# Altium schematic sheet AC-DC PS.SchDoc
size Letter; DocumentNumber: 7; SheetNumber: 7; SheetTotal: 11; Pagesize: Letter
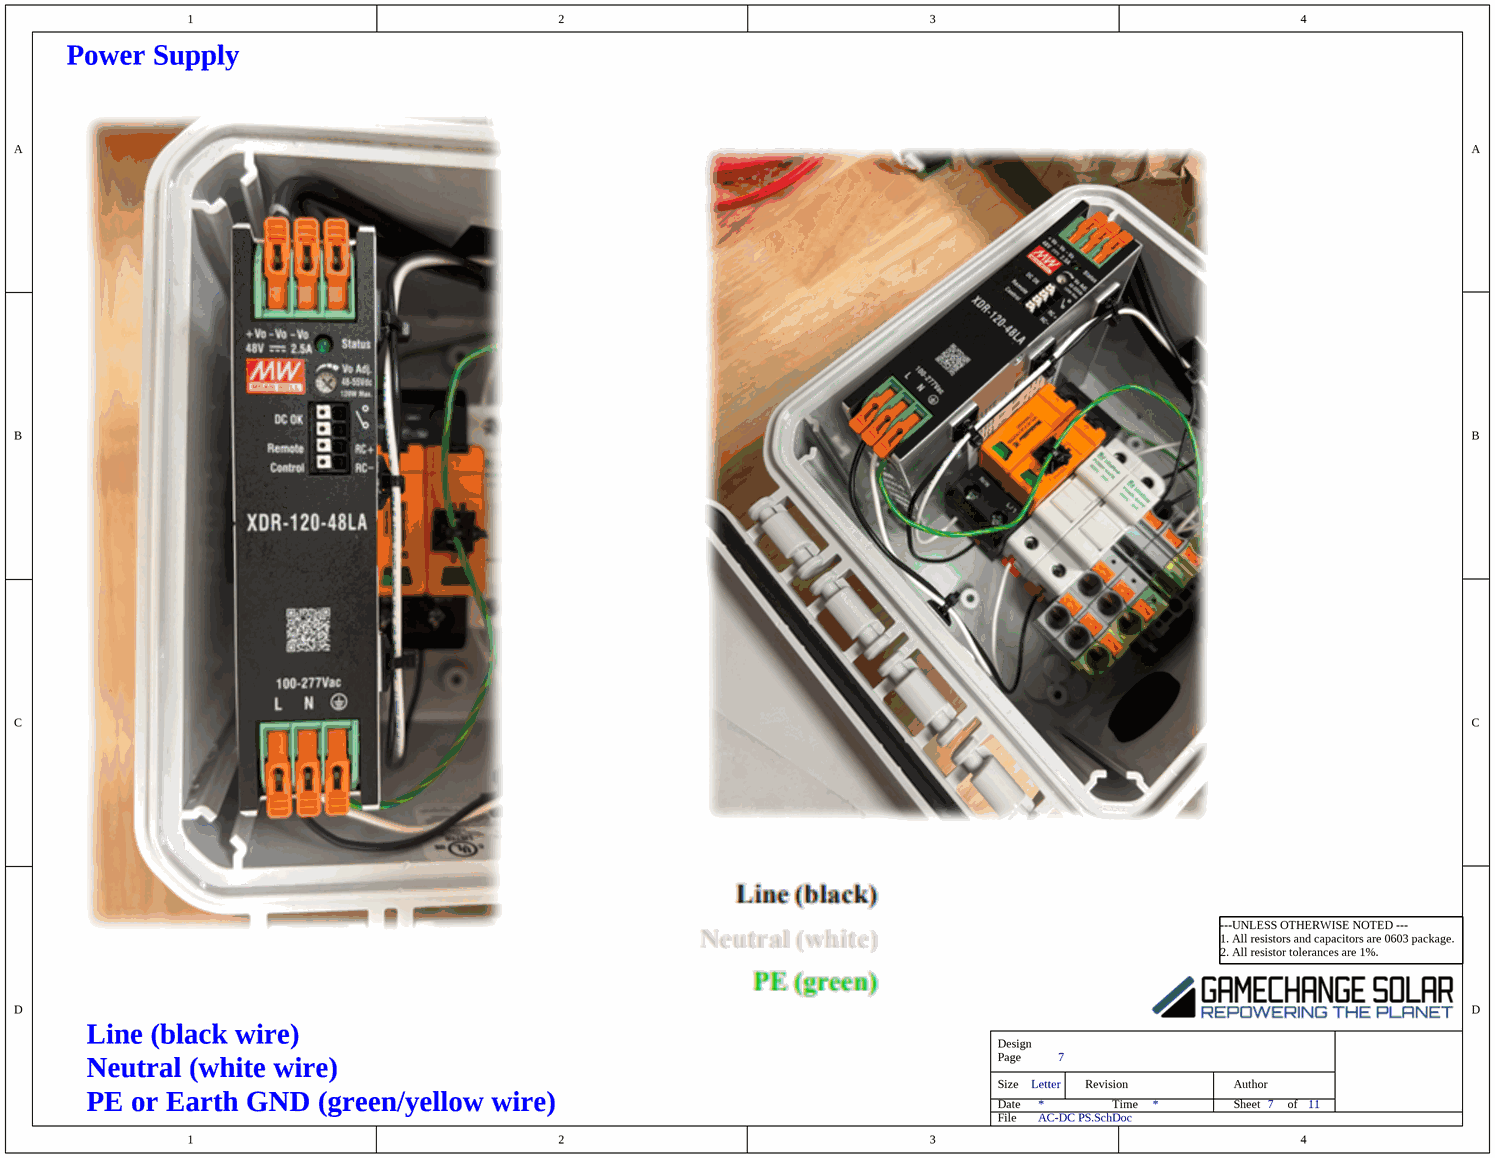
[diagram p0: AC-DC PS.SchDoc]

## Notes on the sheet
- Power Supply
- Line (black wire)
- Neutral (white wire)
- PE or Earth GND (green/yellow wire)
- ---UNLESS OTHERWISE NOTED ---
  1. All resistors and capacitors are 0603 package.
  2. All resistor tolerances are 1%.
- Design
- Size
- Date
- Page
- Revision
- Time
- Sheet
- Author
- of
- File